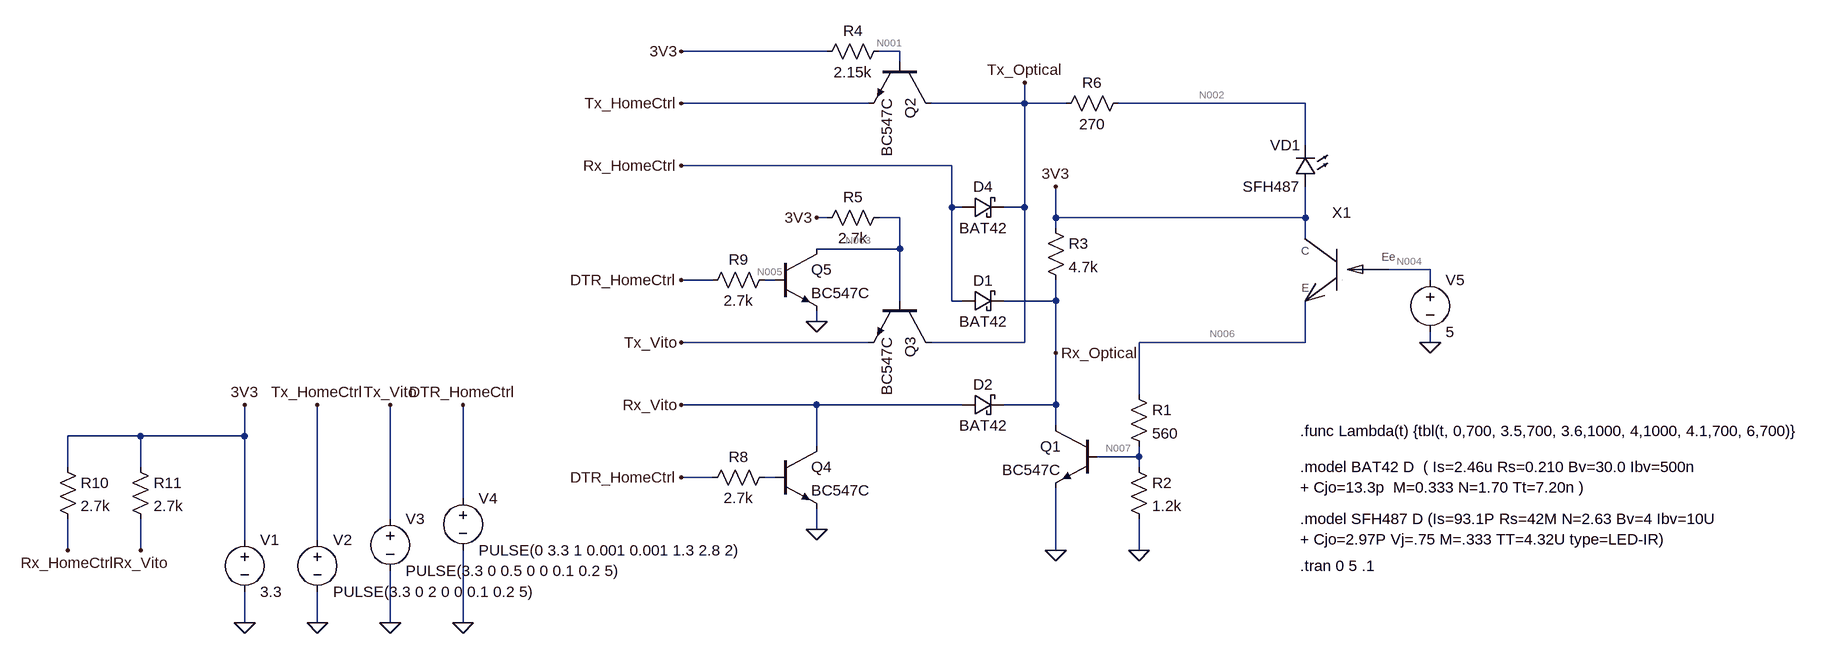
[diagram p0: schematic OptolinkDuoBlock_op.asc]
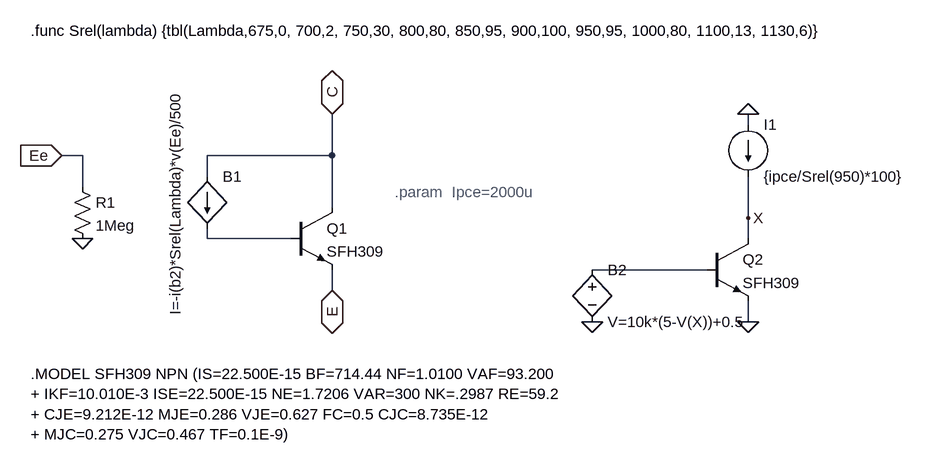
[diagram p1: sub-circuit sfh309fa.asc]
OptolinkDuoBlock_op.asc, the LTspice schematic file:
Version 4
SHEET 1 2356 680
WIRE -80 -1344 -304 -1344
WIRE 32 -1344 0 -1344
WIRE 32 -1328 32 -1344
WIRE -16 -1264 -304 -1264
WIRE 224 -1264 224 -1296
WIRE 224 -1264 80 -1264
WIRE 288 -1264 224 -1264
WIRE 656 -1264 368 -1264
WIRE 656 -1200 656 -1264
WIRE 112 -1168 -304 -1168
WIRE 112 -1104 112 -1168
WIRE 128 -1104 112 -1104
WIRE 224 -1104 224 -1264
WIRE 224 -1104 192 -1104
WIRE -80 -1088 -96 -1088
WIRE 32 -1088 0 -1088
WIRE 272 -1088 272 -1136
WIRE 656 -1088 656 -1136
WIRE 656 -1088 272 -1088
WIRE 272 -1072 272 -1088
WIRE 656 -1056 656 -1088
WIRE 32 -1040 32 -1088
WIRE 32 -1040 -96 -1040
WIRE 848 -1008 784 -1008
WIRE -256 -992 -304 -992
WIRE -160 -992 -176 -992
WIRE 848 -992 848 -1008
WIRE 32 -960 32 -1040
WIRE 112 -960 112 -1104
WIRE 128 -960 112 -960
WIRE 272 -960 272 -992
WIRE 272 -960 192 -960
WIRE -96 -928 -96 -944
WIRE -16 -896 -304 -896
WIRE 224 -896 224 -1104
WIRE 224 -896 80 -896
WIRE 656 -896 656 -960
WIRE 656 -896 400 -896
WIRE 848 -896 848 -912
WIRE 272 -880 272 -960
WIRE 400 -816 400 -896
WIRE -96 -800 -304 -800
WIRE 128 -800 -96 -800
WIRE 272 -800 272 -880
WIRE 272 -800 192 -800
WIRE 272 -768 272 -800
WIRE -1136 -752 -1248 -752
WIRE -976 -752 -976 -800
WIRE -976 -752 -1136 -752
WIRE -96 -736 -96 -800
WIRE 400 -720 400 -736
WIRE 400 -720 336 -720
WIRE -1248 -704 -1248 -752
WIRE -1136 -704 -1136 -752
WIRE 400 -704 400 -720
WIRE -256 -688 -304 -688
WIRE -160 -688 -176 -688
WIRE -640 -656 -640 -800
WIRE -752 -624 -752 -800
WIRE -96 -608 -96 -640
WIRE -976 -592 -976 -752
WIRE -864 -592 -864 -800
WIRE -1248 -576 -1248 -624
WIRE -1136 -576 -1136 -624
WIRE 272 -576 272 -672
WIRE 400 -576 400 -624
WIRE -976 -464 -976 -512
WIRE -864 -464 -864 -512
WIRE -752 -464 -752 -544
WIRE -640 -464 -640 -576
FLAG 400 -576 0
FLAG 272 -576 0
FLAG -304 -800 Rx_Vito
FLAG -304 -1168 Rx_HomeCtrl
FLAG -304 -1264 Tx_HomeCtrl
FLAG -304 -896 Tx_Vito
FLAG -304 -1344 3V3
FLAG -864 -464 0
FLAG -752 -464 0
FLAG -976 -464 0
FLAG -976 -800 3V3
FLAG -752 -800 Tx_Vito
FLAG -864 -800 Tx_HomeCtrl
FLAG 272 -1136 3V3
FLAG 224 -1296 Tx_Optical
FLAG 272 -880 Rx_Optical
FLAG -304 -992 DTR_HomeCtrl
FLAG -640 -464 0
FLAG -640 -800 DTR_HomeCtrl
FLAG -96 -928 0
FLAG -96 -1088 3V3
FLAG -96 -608 0
FLAG -1248 -576 Rx_HomeCtrl
FLAG -1136 -576 Rx_Vito
FLAG 848 -896 0
FLAG -304 -688 DTR_HomeCtrl
SYMBOL res 384 -832 R0
SYMATTR InstName R1
SYMATTR Value 560
SYMBOL res 384 -720 R0
SYMATTR InstName R2
SYMATTR Value 1.2k
SYMBOL npn 336 -768 M0
SYMATTR InstName Q1
SYMATTR Value BC547C
SYMBOL npn 80 -960 R90
SYMATTR InstName Q3
SYMATTR Value BC547C
SYMBOL schottky 128 -944 R270
WINDOW 0 32 32 VTop 2
WINDOW 3 0 32 VBottom 2
SYMATTR InstName D1
SYMATTR Value BAT42
SYMBOL schottky 128 -784 R270
WINDOW 0 32 32 VTop 2
WINDOW 3 0 32 VBottom 2
SYMATTR InstName D2
SYMATTR Value BAT42
SYMBOL res 16 -1104 R90
WINDOW 0 0 56 VBottom 2
WINDOW 3 32 56 VTop 2
SYMATTR InstName R5
SYMATTR Value 2.7k
SYMBOL npn 80 -1328 R90
SYMATTR InstName Q2
SYMATTR Value BC547C
SYMBOL res 16 -1360 R90
WINDOW 0 0 56 VBottom 2
WINDOW 3 32 56 VTop 2
SYMATTR InstName R4
SYMATTR Value 2.15k
SYMBOL res 384 -1280 R90
WINDOW 0 0 56 VBottom 2
WINDOW 3 32 56 VTop 2
SYMATTR InstName R6
SYMATTR Value 270
SYMBOL LED 672 -1136 R180
WINDOW 0 24 64 Left 2
WINDOW 3 24 0 Left 2
SYMATTR InstName VD1
SYMATTR Value SFH487
SYMBOL res 256 -1088 R0
SYMATTR InstName R3
SYMATTR Value 4.7k
SYMBOL schottky 128 -1088 R270
WINDOW 0 32 32 VTop 2
WINDOW 3 0 32 VBottom 2
SYMATTR InstName D4
SYMATTR Value BAT42
SYMBOL voltage -976 -608 R0
WINDOW 123 0 0 Left 0
WINDOW 39 0 0 Left 0
SYMATTR InstName V1
SYMATTR Value 3.3
SYMBOL voltage -864 -608 R0
WINDOW 123 0 0 Left 0
WINDOW 39 0 0 Left 0
SYMATTR InstName V2
SYMATTR Value PULSE(3.3 0 2 0 0 0.1 0.2 5)
SYMBOL voltage -752 -640 R0
WINDOW 123 0 0 Left 0
WINDOW 39 0 0 Left 0
SYMATTR InstName V3
SYMATTR Value PULSE(3.3 0 0.5 0 0 0.1 0.2 5)
SYMBOL voltage 848 -1008 R0
WINDOW 123 0 0 Left 0
WINDOW 39 0 0 Left 0
SYMATTR InstName V5
SYMATTR Value 5
SYMBOL voltage -640 -672 R0
WINDOW 123 0 0 Left 0
WINDOW 39 0 0 Left 0
SYMATTR InstName V4
SYMATTR Value PULSE(0 3.3 1 0.001 0.001 1.3 2.8 2)
SYMBOL npn -160 -1040 R0
SYMATTR InstName Q5
SYMATTR Value BC547C
SYMBOL res -160 -704 R90
WINDOW 0 0 56 VBottom 2
WINDOW 3 32 56 VTop 2
SYMATTR InstName R8
SYMATTR Value 2.7k
SYMBOL npn -160 -736 R0
SYMATTR InstName Q4
SYMATTR Value BC547C
SYMBOL res -160 -1008 R90
WINDOW 0 0 56 VBottom 2
WINDOW 3 32 56 VTop 2
SYMATTR InstName R9
SYMATTR Value 2.7k
SYMBOL res -1264 -720 R0
SYMATTR InstName R10
SYMATTR Value 2.7k
SYMBOL res -1152 -720 R0
SYMATTR InstName R11
SYMATTR Value 2.7k
SYMBOL SFH309FA 720 -1040 M0
SYMATTR InstName X1
TEXT 648 -552 Left 2 !.tran 0 5 .1
TEXT 648 -624 Left 2 !.model SFH487 D (Is=93.1P Rs=42M N=2.63 Bv=4 Ibv=10U\n+ Cjo=2.97P Vj=.75 M=.333 TT=4.32U type=LED-IR)
TEXT 648 -704 Left 2 !.model BAT42 D  ( Is=2.46u Rs=0.210 Bv=30.0 Ibv=500n\n+ Cjo=13.3p  M=0.333 N=1.70 Tt=7.20n )
TEXT 648 -760 Left 2 !.func Lambda(t) {tbl(t, 0,700, 3.5,700, 3.6,1000, 4,1000, 4.1,700, 6,700)}

sfh309fa.asc, the sub-circuit schematic file:
Version 4
SHEET 1 1664 680
WIRE 864 -384 864 -400
WIRE -160 -336 -192 -336
WIRE 224 -336 224 -400
WIRE 224 -336 32 -336
WIRE 32 -304 32 -336
WIRE -160 -288 -160 -336
WIRE 224 -256 224 -336
WIRE 864 -240 864 -304
WIRE 32 -208 32 -224
WIRE 160 -208 32 -208
WIRE 864 -208 864 -240
WIRE 800 -160 624 -160
WIRE 224 -128 224 -160
WIRE 864 -80 864 -112
FLAG -160 -208 0
FLAG -192 -336 Ee
IOPIN -192 -336 In
FLAG 224 -400 C
IOPIN 224 -400 BiDir
FLAG 224 -128 E
IOPIN 224 -128 BiDir
FLAG 864 -400 0
FLAG 864 -80 0
FLAG 624 -80 0
FLAG 864 -240 X
SYMBOL npn 160 -256 R0
SYMATTR InstName Q1
SYMATTR Value SFH309
SYMBOL bi 32 -304 R0
WINDOW 3 -49 -134 VRight 2
SYMATTR Value I=-i(b2)*Srel(Lambda)*v(Ee)/500
SYMATTR InstName B1
SYMBOL res -176 -304 R0
SYMATTR InstName R1
SYMATTR Value 1Meg
SYMBOL npn 800 -208 R0
SYMATTR InstName Q2
SYMATTR Value SFH309
SYMBOL current 864 -384 R0
SYMATTR InstName I1
SYMATTR Value {ipce/Srel(950)*100}
SYMBOL bv 624 -176 R0
SYMATTR InstName B2
SYMATTR Value V=10k*(5-V(X))+0.5
TEXT -240 0 Left 2 !.MODEL SFH309 NPN (IS=22.500E-15 BF=714.44 NF=1.0100 VAF=93.200\n+ IKF=10.010E-3 ISE=22.500E-15 NE=1.7206 VAR=300 NK=.2987 RE=59.2\n+ CJE=9.212E-12 MJE=0.286 VJE=0.627 FC=0.5 CJC=8.735E-12\n+ MJC=0.275 VJC=0.467 TF=0.1E-9)
TEXT -240 -528 Left 2 !.func Srel(lambda) {tbl(Lambda,675,0, 700,2, 750,30, 800,80, 850,95, 900,100, 950,95, 1000,80, 1100,13, 1130,6)}
TEXT 320 -280 Left 2 ;.param  Ipce=2000u

The netlist it stands for:
* OptolinkDuoBlock_op.asc
R1 N006 N007 560
R2 N007 0 1.2k
Q1 Rx_Optical N007 0 0 BC547C
Q3 Tx_Optical N003 Tx_Vito 0 BC547C
D1 Rx_HomeCtrl Rx_Optical BAT42
D2 Rx_Vito Rx_Optical BAT42
R5 N003 3V3 2.7k
Q2 Tx_Optical N001 Tx_HomeCtrl 0 BC547C
R4 N001 3V3 2.15k
R6 N002 Tx_Optical 270
D§VD1 3V3 N002 SFH487
R3 3V3 Rx_Optical 4.7k
D4 Rx_HomeCtrl Tx_Optical BAT42
V1 3V3 0 3.3
V2 Tx_HomeCtrl 0 PULSE(3.3 0 2 0 0 0.1 0.2 5)
V3 Tx_Vito 0 PULSE(3.3 0 0.5 0 0 0.1 0.2 5)
V5 N004 0 5
V4 DTR_HomeCtrl 0 PULSE(0 3.3 1 0.001 0.001 1.3 2.8 2)
Q5 N003 N005 0 0 BC547C
R8 N008 DTR_HomeCtrl 2.7k
Q4 Rx_Vito N008 0 0 BC547C
R9 N005 DTR_HomeCtrl 2.7k
R10 3V3 Rx_HomeCtrl 2.7k
R11 3V3 Rx_Vito 2.7k
XX1 N004 3V3 N006 sfh309fa

* block symbol definitions
.subckt sfh309fa Ee C E
Q1 C N001 E 0 SFH309
B1 C N001 I=-i(b2)*Srel(Lambda)*v(Ee)/500
R1 Ee 0 1Meg
Q2 X N002 0 0 SFH309
I1 0 X {ipce/Srel(950)*100}
B2 N002 0 V=10k*(5-V(X))+0.5
.MODEL SFH309 NPN (IS=22.500E-15 BF=714.44 NF=1.0100 VAF=93.200
+ IKF=10.010E-3 ISE=22.500E-15 NE=1.7206 VAR=300 NK=.2987 RE=59.2
+ CJE=9.212E-12 MJE=0.286 VJE=0.627 FC=0.5 CJC=8.735E-12
+ MJC=0.275 VJC=0.467 TF=0.1E-9)
.func Srel(lambda) {tbl(Lambda,675,0, 700,2, 750,30, 800,80, 850,95, 900,100, 950,95, 1000,80, 1100,13, 1130,6)}
* .param  Ipce=2000u
.ends sfh309fa

.model D D
.lib standard.dio
.model NPN NPN
.model PNP PNP
.lib standard.bjt
.tran 0 5 .1
.model SFH487 D (Is=93.1P Rs=42M N=2.63 Bv=4 Ibv=10U
+ Cjo=2.97P Vj=.75 M=.333 TT=4.32U type=LED-IR)
.model BAT42 D  ( Is=2.46u Rs=0.210 Bv=30.0 Ibv=500n
+ Cjo=13.3p  M=0.333 N=1.70 Tt=7.20n )
.func Lambda(t) {tbl(t, 0,700, 3.5,700, 3.6,1000, 4,1000, 4.1,700, 6,700)}
.backanno
.end

* Results of the author's LTspice run, read from the files saved beside the schematic
* Operating Point, zero values left out:
*   V(n006) = 3.014 V
*   V(n007) = 724.2 mV
*   V(rx_optical) = 4.666 mV
*   V(tx_optical) = 2.853 V
*   V(n003) = 3.3 V
*   V(tx_vito) = 3.3 V
*   V(rx_homectrl) = 274.3 mV
*   V(rx_vito) = 274.2 mV
*   V(3v3) = 3.3 V
*   V(n001) = 3.3 V
*   V(tx_homectrl) = 3.3 V
*   V(n002) = 2.853 V
*   V(n004) = 5 V
*   V(n005) = 8.983 nV
*   Ic(Q5) = 3.377 pA
*   Ib(Q5) = -3.327 pA
*   Ic(Q2) = -1.199 µA
*   Ib(Q2) = 154.8 nA
*   Ie(Q2) = 1.044 µA
*   Ic(Q3) = -1.195 µA
*   Ib(Q3) = 154.4 nA
*   Ie(Q3) = 1.041 µA
*   Ic(Q1) = 2.945 mA
*   Ib(Q1) = 3.486 mA
*   Ie(Q1) = -6.431 mA
*   I(Vd1) = 65.92 nA
*   I(D4) = -2.46 µA
*   I(D2) = 1.121 mA
*   I(D1) = 1.123 mA
*   I(R11) = 1.121 mA
*   I(R10) = 1.121 mA
*   I(R9) = 3.327 pA
*   I(R3) = 701.1 µA
*   I(R6) = 65.92 nA
*   I(R4) = -154.8 nA
*   I(R5) = -154.4 nA
*   I(R2) = 603.5 µA
*   I(R1) = 4.09 mA
*   I(V4) = 3.629 pA
*   I(V5) = -5 µA
*   I(V3) = -1.041 µA
*   I(V2) = -1.044 µA
*   I(V1) = -7.032 mA
*   Ix(x1:EE) = 5 µA
*   Ix(x1:C) = 4.09 mA
*   Ix(x1:E) = -4.09 mA
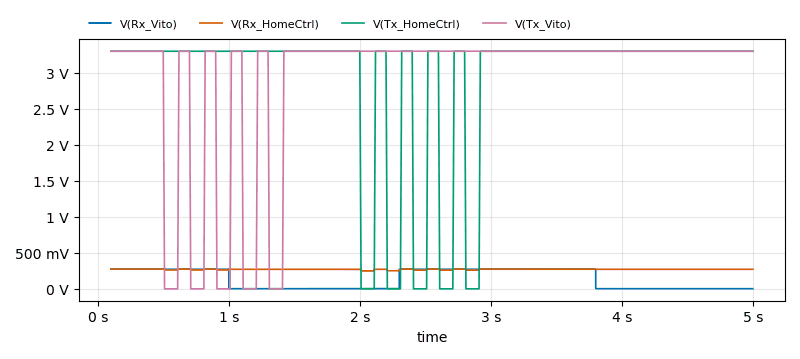
[diagram p2: Transient Analysis of OptolinkDuoBlock_op.asc, plotted from the saved traces]
* Transient Analysis, 1 run:
*   V(Rx_Vito): min 2.233 mV, max 274.2 mV, average 135.3 mV, rms 191.7 mV, last 2.234 mV
*   V(Rx_HomeCtrl): min 250.1 mV, max 274.3 mV, average 270.5 mV, rms 270.5 mV, last 271.8 mV
*   V(Tx_HomeCtrl): min 0 V, max 3.3 V, average 2.93 V, rms 3.103 V, last 3.3 V
*   V(Tx_Vito): min 0 V, max 3.3 V, average 2.93 V, rms 3.106 V, last 3.3 V